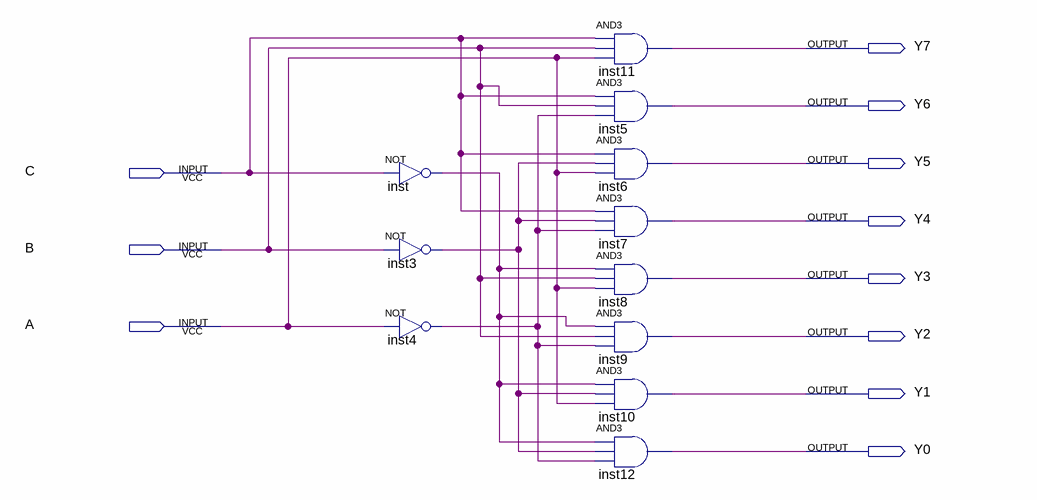
[diagram p0: schematic sheet]
// Quartus schematic MY_3-8.bdf as structural Verilog: 11 symbols, 11 pins
module \MY_3-8  (
  input  C,
  input  B,
  input  A,
  output Y7,
  output Y6,
  output Y5,
  output Y4,
  output Y3,
  output Y2,
  output Y1,
  output Y0
);

  wire inst3_out, inst4_out, inst_out;

  not inst (inst_out, C);
  not inst3 (inst3_out, B);
  not inst4 (inst4_out, A);
  and inst11 (Y7, C, B, A);
  and inst5 (Y6, C, B, inst4_out);
  and inst6 (Y5, C, inst3_out, A);
  and inst7 (Y4, C, inst3_out, inst4_out);
  and inst8 (Y3, inst_out, B, A);
  and inst9 (Y2, inst_out, B, inst4_out);
  and inst10 (Y1, inst_out, inst3_out, A);
  and inst12 (Y0, inst_out, inst3_out, inst4_out);
endmodule
